# Altium project unisat_trx_hw.PrjPCB
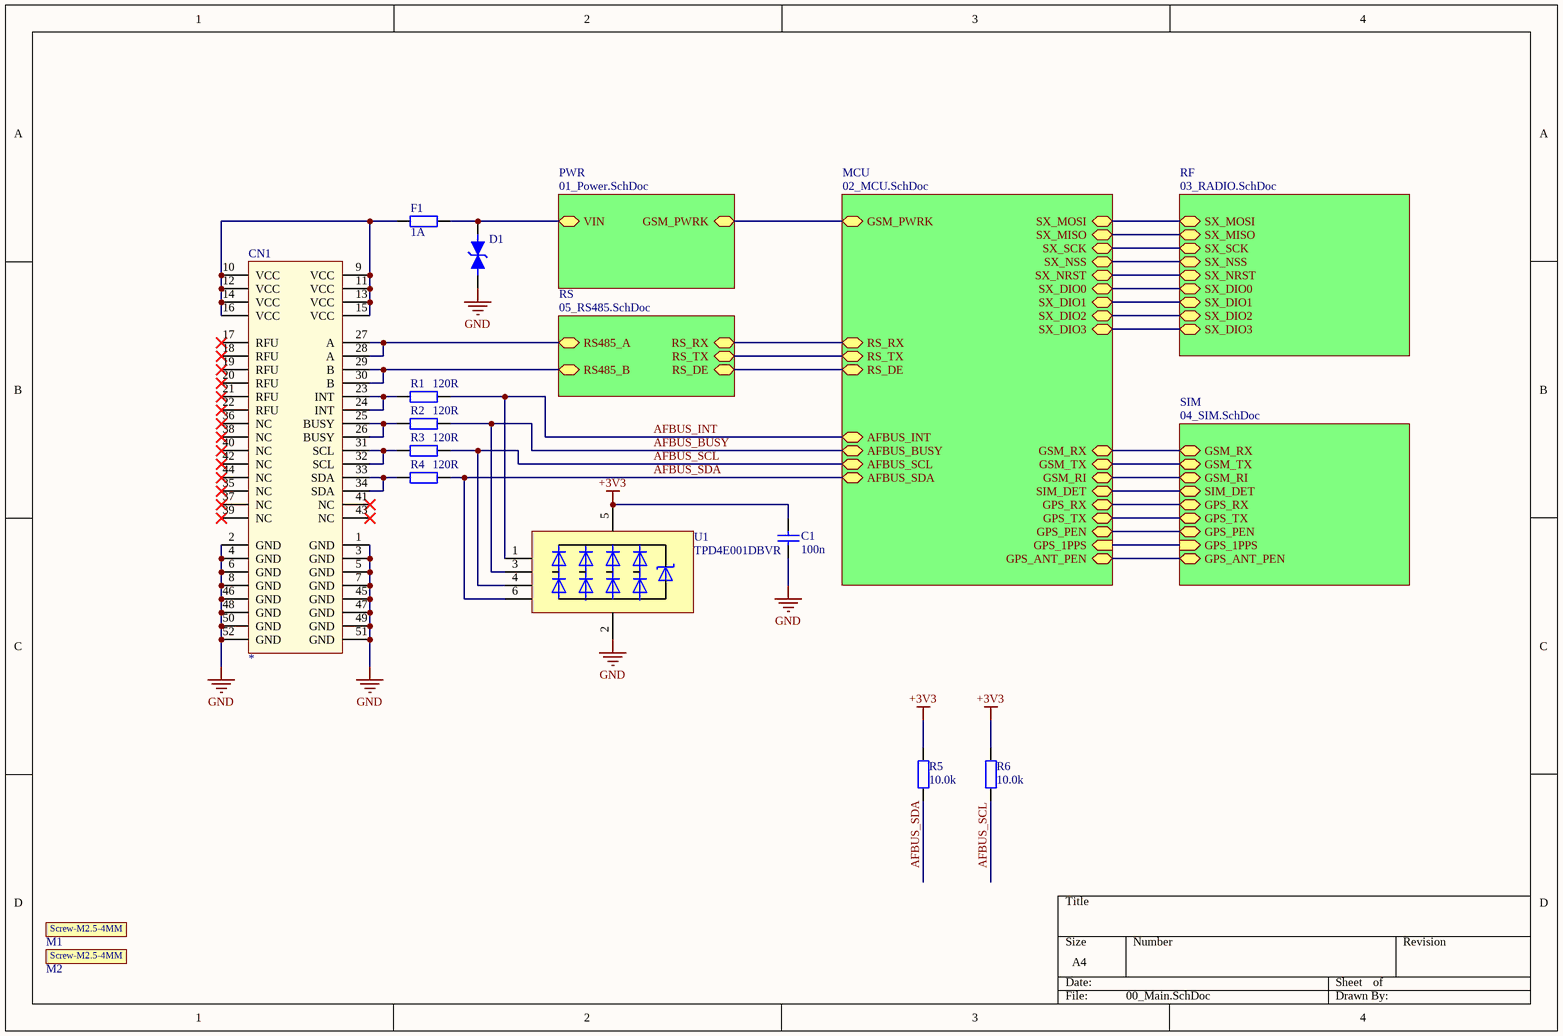
[diagram p0: 00_Main.SchDoc]
hwver: v03
6 sheets, 105 parts. Net scope: hierarchical (ports join the sheet entries above them; power ports are global).
Board files: unisat_trx_board.PcbDoc, unisat_trx_board_panelize.PcbDoc
Sheets:
  00_Main.SchDoc
    RS = 05_RS485.SchDoc
    PWR = 01_Power.SchDoc
    SIM = 04_SIM.SchDoc
    MCU = 02_MCU.SchDoc
    RF = 03_RADIO.SchDoc

## Sheet 00_Main.SchDoc
size A4

### Parts
C1  100n  [C0603_IPC_MD]
CN1  *  [PCI-E-MINI]  (no BOM)
D1  824501121  [DIOM4227X25N]  (value not drawn)
F1  1A  [R0603_IPC_MD]
M1  Screw-M2.5-4MM  (value not drawn)  (mechanical)
M2  Screw-M2.5-4MM  (value not drawn)  (mechanical)
R1  120R  [R0603_IPC_MD]
R2  120R  [R0603_IPC_MD]
R3  120R  [R0603_IPC_MD]
R4  120R  [R0603_IPC_MD]
R5  10.0k  [R0603_IPC_MD]
R6  10.0k  [R0603_IPC_MD]
U1  TPD4E001DBVR  [SOT23-6]

### Sub-sheets
MCU = 02_MCU.SchDoc: GSM_PWRK, RS_RX, RS_TX, RS_DE, SX_MOSI, SX_MISO, SX_SCK, SX_NSS, SX_NRST, SX_DIO1, SX_DIO2, SX_DIO3, SX_DIO0, AFBUS_SDA, AFBUS_SCL, AFBUS_BUSY, AFBUS_INT, GSM_RX, GSM_TX, GSM_RI, GPS_RX, GPS_TX, GPS_PEN, GPS_1PPS (in), SIM_DET, GPS_ANT_PEN
PWR = 01_Power.SchDoc: VIN, GSM_PWRK
RF = 03_RADIO.SchDoc: SX_MOSI, SX_MISO, SX_SCK, SX_NSS, SX_NRST, SX_DIO0, SX_DIO1, SX_DIO2, SX_DIO3
RS = 05_RS485.SchDoc: RS485_A, RS485_B, RS_RX, RS_TX, RS_DE
SIM = 04_SIM.SchDoc: GSM_RX, GSM_TX, GSM_RI, GPS_RX, GPS_TX, GPS_PEN, GPS_1PPS (in), SIM_DET, GPS_ANT_PEN

### Nets
+3V3: C1.1 R5.2 R6.2 U1.5(VCC)
GND: C1.2 CN1.1(GND) CN1.2(GND) CN1.3(GND) CN1.4(GND) CN1.5(GND) CN1.6(GND) CN1.7(GND) CN1.8(GND) CN1.45(GND) CN1.46(GND) CN1.47(GND) CN1.48(GND) CN1.49(GND) CN1.50(GND) CN1.51(GND) CN1.52(GND) D1.1 U1.2(GND)
AFBUS_BUSY: R2.2 U1.3(IO2) ; sheet MCU/AFBUS_BUSY
AFBUS_INT: R1.2 U1.1(IO1) ; sheet MCU/AFBUS_INT
AFBUS_SCL: R3.2 R6.1 U1.4(IO3) ; sheet MCU/AFBUS_SCL
AFBUS_SDA: R4.2 R5.1 U1.6(IO4) ; sheet MCU/AFBUS_SDA
SIM_DET: sheet SIM/SIM_DET, sheet MCU/SIM_DET
VIN: D1.2 F1.2 ; sheet PWR/VIN
NetCN1_9: CN1.9(VCC) CN1.10(VCC) CN1.11(VCC) CN1.12(VCC) CN1.13(VCC) CN1.14(VCC) CN1.15(VCC) CN1.16(VCC) F1.1
NetCN1_23: CN1.23(INT) CN1.24(INT) R1.1
NetCN1_25: CN1.25(BUSY) CN1.26(BUSY) R2.1
NetCN1_27: CN1.27(A) CN1.28(A) ; sheet RS/RS485_A
NetCN1_29: CN1.29(B) CN1.30(B) ; sheet RS/RS485_B
NetCN1_31: CN1.31(SCL) CN1.32(SCL) R3.1
NetCN1_33: CN1.33(SDA) CN1.34(SDA) R4.1
NetCN8_1: sheet RS/RS_RX, sheet MCU/RS_RX
NetCN8_2: sheet RS/RS_DE, sheet MCU/RS_DE
NetCN8_4: sheet RS/RS_TX, sheet MCU/RS_TX
NetR12_1: sheet PWR/GSM_PWRK, sheet MCU/GSM_PWRK
NetR21_1: sheet SIM/GSM_RI, sheet MCU/GSM_RI
NetR22_1: sheet SIM/GSM_RX, sheet MCU/GSM_RX
NetR23_1: sheet SIM/GSM_TX, sheet MCU/GSM_TX
NetR26_1: sheet SIM/GPS_PEN, sheet MCU/GPS_PEN
NetR29_1: sheet SIM/GPS_1PPS, sheet MCU/GPS_1PPS
NetR30_1: sheet SIM/GPS_RX, sheet MCU/GPS_RX
NetR31_1: sheet SIM/GPS_TX, sheet MCU/GPS_TX
NetR36_1: sheet SIM/GPS_ANT_PEN, sheet MCU/GPS_ANT_PEN
NetU4_22: sheet MCU/SX_NRST, sheet RF/SX_NRST
NetU4_23: sheet MCU/SX_DIO0, sheet RF/SX_DIO0
NetU4_24: sheet MCU/SX_DIO1, sheet RF/SX_DIO1
NetU4_25: sheet MCU/SX_DIO2, sheet RF/SX_DIO2
NetU4_26: sheet MCU/SX_DIO3, sheet RF/SX_DIO3
NetU4_34: sheet MCU/SX_SCK, sheet RF/SX_SCK
NetU4_35: sheet MCU/SX_MISO, sheet RF/SX_MISO
NetU4_36: sheet MCU/SX_MOSI, sheet RF/SX_MOSI
NetU4_37: sheet MCU/SX_NSS, sheet RF/SX_NSS

Not connected (* = marked no-connect by the designer): CN1 17(RFU)* 18(RFU)* 19(RFU)* 20(RFU)* 21(RFU)* 22(RFU)* 35(NC)* 36(NC)* 37(NC)* 38(NC)* 39(NC)* 40(NC)* 41(NC)* 42(NC)* 43(NC)* 44(NC)*

### Library data of the parts
C1 = CL10B104KO8WPNC: CAP CER 0.1UF 16V X7R 0603; Manufacturer: Samsung Electro-Mechanics; Manufacturer Part Number: CL10B104KO8WPNC; Voltage: 16V; Value: 100n; Dielectric: X7R; Supplier 1: Digi-Key; Supplier Part Number 1: 1276-6582-1-ND
CN1 = ALAFASAT_TRX_EDGE_CONN: EDGE CONN PCI EXP MINI 52POS; Manufacturer: *; Manufacturer Part Number: *; Supplier 1: *; Supplier Part Number 1: *
D1 = 824501121_TVS: TVS DIODE 12V 19.9V DO214AC; Manufacturer: Wurth Electronics Inc.; Voltage - Reverse Standoff (Typ): 12V (Max); Current - Average Rectified (Io): 1A; Manufacturer Part Number: 824501121; Supplier 1: Digi-Key; Supplier Part Number 1: 732-9949-1-ND
F1 = MFU0603FF01000P500: FUSE BOARD MOUNT 1A 32VDC 0603; Manufacturer: Bourns Inc.; Value: 1A; Manufacturer Part Number: MFU0603FF01000P500; Supplier 1: Digi-Key; Supplier Part Number 1: 749-1742-1-ND
M1 M2 = Screw-M2.5-4MM: Manufacturer: China; Manufacturer Part Number: Screw-M2.5-4MM; Supplier 1: Aliexpress; Supplier Part Number 1: Screw-M2.5-4MM
R1-R4 = RC0603JR-07120RL: RES SMD 120 OHM 5% 1/10W 0603; Manufacturer: Yageo; Value: 120R; Tolarance: 5%; Manufacturer Part Number: RC0603JR-07120RL; Supplier 1: Digi-Key; Supplier Part Number 1: 311-120GRCT-ND
R5 R6 = RMCF0603FT10K0: RES 10K OHM 1% 1/10W 0603; Manufacturer: Stackpole Electronics Inc; Value: 10.0k; Tolarance: 1%; Manufacturer Part Number: RMCF0603FT10K0; Supplier 1: Digi-Key; Supplier Part Number 1: RMCF0603FT10K0CT-ND
U1 = TPD4E001DBVR: 4x TVS DIODE 5.5V SOT23-6; Manufacturer: TI; Manufacturer Part Number: TPD4E001DBVR; Supplier 1: Digi-Key; Supplier Part Number 1: 296-28203-1-ND

## Sheet 05_RS485.SchDoc
size A4; Revision: A
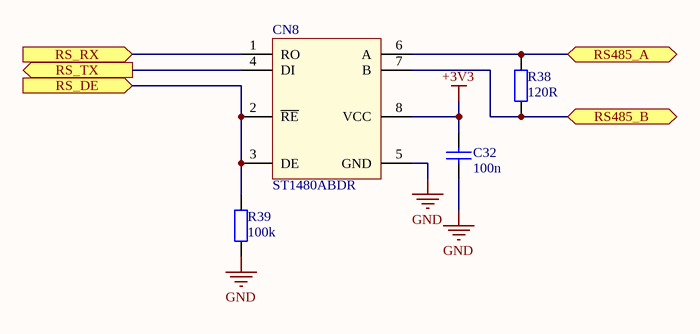
[diagram p1: 05_RS485.SchDoc]

### Parts
C32  100n  [C0603_IPC_MD]
CN8  ST1480ABDR  [SOIC-8]
R38  120R  [R0603_IPC_MD]
R39  100k  [R0603_IPC_MD]

### Ports
RS485_A (bidir), RS485_B (bidir), RS_DE (in), RS_RX (in), RS_TX (out)

### Nets
+3V3: C32.2 CN8.8(VCC)
GND: C32.1 CN8.5(GND) R39.1
NetCN1_27: CN8.6(A) R38.2 ; port RS485_A
NetCN1_29: CN8.7(B) R38.1 ; port RS485_B
NetCN8_1: CN8.1(RO) ; port RS_RX
NetCN8_2: CN8.2(~{RE}) CN8.3(DE) R39.2 ; port RS_DE
NetCN8_4: CN8.4(DI) ; port RS_TX

### Notes on the sheet
- Title
- Size:
- Date:
- A4
- Number:
- Time:
- Revision:
- Sheet
- of
- File:

### Library data of the parts
C32 = CL10B104KO8WPNC: as C1 on sheet 00_Main; Manufacturer Part Number: CL10B104KO8WPNC; Voltage: 16V; Value: 100n; Dielectric: X7R; Supplier 1: Digi-Key; Supplier Part Number 1: 1276-6582-1-ND
CN8 = ST1480ABDR: IC TXRX 3.3V RS485/422 8 SOIC; Manufacturer: STMicroelectronics; Manufacturer Part Number: ST1480ABDR; Supplier 1: Digi-Key; Supplier Part Number 1: 497-2046-1-ND
R38 = RC0603JR-07120RL: as R1 on sheet 00_Main; Value: 120R; Tolarance: 5%; Manufacturer Part Number: RC0603JR-07120RL; Supplier 1: Digi-Key; Supplier Part Number 1: 311-120GRCT-ND
R39 = RMCF0603FT100K: RES 100K OHM 1% 1/10W 0603; Manufacturer: Bourns Inc.; Value: 100k; Tolarance: 1%; Manufacturer Part Number: RMCF0603FT100K; Supplier 1: Digi-Key; Supplier Part Number 1: RMCF0603FT100KCT-ND

## Sheet 01_Power.SchDoc
size A3
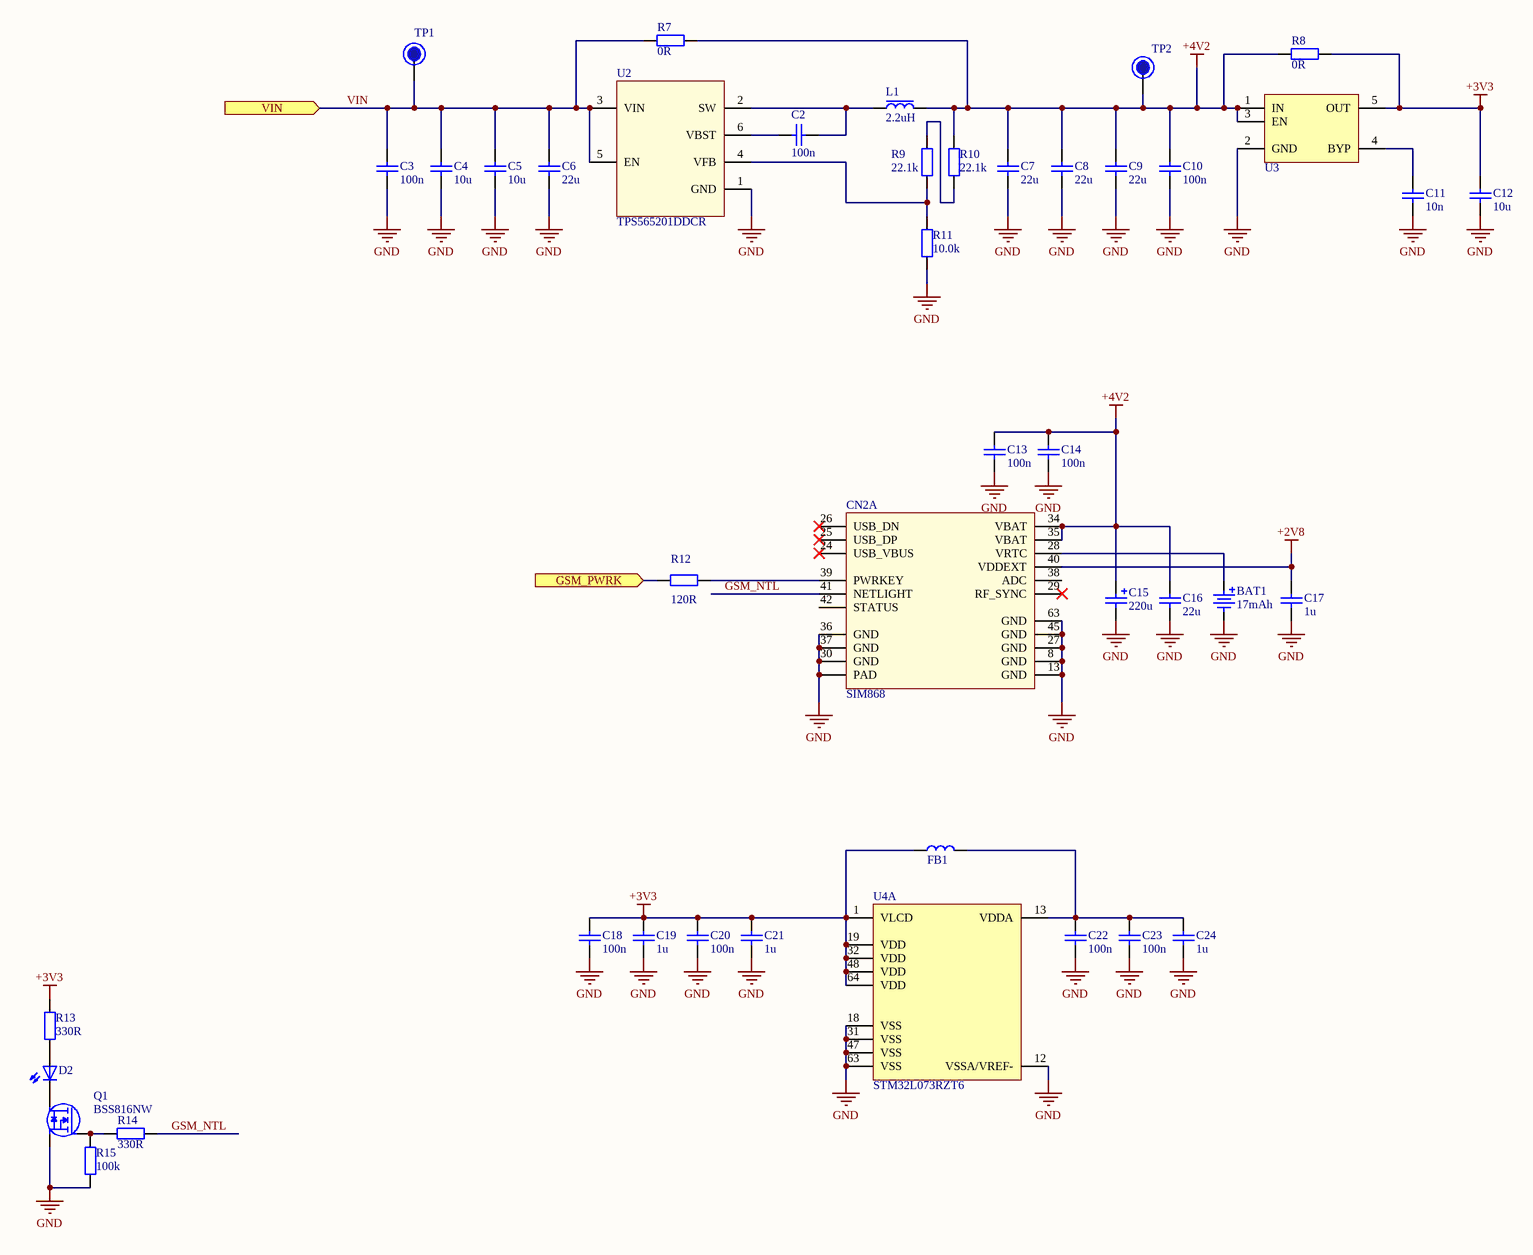
[diagram p2: 01_Power.SchDoc]

### Parts
BAT1  17mAh  [ML1220]
C2  100n  [C0603_IPC_MD]
C3  100n  [C0603_IPC_MD]
C4  10u  [C0805_IPC_MD]
C5  10u  [C0805_IPC_MD]
C6  22u  [C0805_IPC_MD]
C7  22u  [C0805_IPC_MD]
C8  22u  [C0805_IPC_MD]
C9  22u  [C0805_IPC_MD]
C10  100n  [C0603_IPC_MD]
C11  10n  [C0603_IPC_MD]
C12  10u  [C0805_IPC_MD]
C13  100n  [C0603_IPC_MD]
C14  100n  [C0603_IPC_MD]
C15  220u  [TANT_CAP_7343]
C16  22u  [C0805_IPC_MD]
C17  1u  [C0603_IPC_MD]
C18  100n  [C0603_IPC_MD]
C19  1u  [C0603_IPC_MD]
C20  100n  [C0603_IPC_MD]
C21  1u  [C0603_IPC_MD]
C22  100n  [C0603_IPC_MD]
C23  100n  [C0603_IPC_MD]
C24  1u  [C0603_IPC_MD]
CN2  SIM868  [SIM868]  (part A of 2)
D2  LTST-C190GKT  [LED_0603]  (value not drawn)
FB1  MH1608-601Y  [L0603_IPC_MD]  (value not drawn)
L1  2.2uH  [ASPI-0520LR]
Q1  BSS816NW  [SOT323]
R7  0R  [R0603_IPC_MD]  (no BOM)
R8  0R  [R0603_IPC_MD]  (no BOM)
R9  22.1k  [R0603_IPC_MD]
R10  22.1k  [R0603_IPC_MD]
R11  10.0k  [R0603_IPC_MD]
R12  120R  [R0603_IPC_MD]
R13  330R  [R0603_IPC_MD]
R14  330R  [R0603_IPC_MD]
R15  100k  [R0603_IPC_MD]
TP1  VIN  [TestPoint_1M5]  (value not drawn)  (no BOM)
TP2  4V2  [TestPoint_1M5]  (value not drawn)  (no BOM)
U2  TPS565201DDCR  [SOT23-6_(TI)]
U3  MIC5219-3.3YM5-TR  [SOT23-5_(MT)]  (value not drawn)
U4  STM32L073RZT6  [LQFP64_10X10MM]  (part A of 2)

### Ports
GSM_PWRK (in), VIN (in)

### Nets
+2V8: C17.2 CN2.40(VDDEXT)
+3V3: C12.2 C18.2 C19.2 C20.2 C21.2 FB1.1 R8.2 R13.2 U3.5(OUT) U4.1(VLCD) U4.19(VDD) U4.32(VDD) U4.48(VDD) U4.64(VDD)
+4V2: C7.1 C8.1 C9.1 C10.1 C13.2 C14.2 C15.1 C16.1 CN2.34(VBAT) CN2.35(VBAT) L1.2 R7.2 R8.1 R10.2 TP2.0 U3.1(IN) U3.3(EN)
GND: BAT1.2 C3.2 C4.1 C5.1 C6.2 C7.2 C8.2 C9.2 C10.2 C11.1 C12.1 C13.1 C14.1 C15.2 C16.2 C17.1 C18.1 C19.1 C20.1 C21.1 C22.1 C23.1 C24.1 CN2.8(GND) CN2.13(GND) CN2.27(GND) CN2.30(GND) CN2.36(GND) CN2.37(GND) CN2.45(GND) CN2.63(GND) CN2.PAD Q1.2(S) R11.1 R15.1 U2.1(GND) U3.2(GND) U4.12(VSSA/VREF-) U4.18(VSS) U4.31(VSS) U4.47(VSS) U4.63(VSS)
GSM_NTL: CN2.41(NETLIGHT) R14.2
VIN: C3.1 C4.2 C5.2 C6.1 R7.1 TP1.0 U2.3(VIN) U2.5(EN) ; port VIN
NetBAT1_1: BAT1.1 CN2.28(VRTC)
NetC2_1: C2.1 L1.1 U2.2(SW)
NetC2_2: C2.2 U2.6(VBST)
NetC11_2: C11.2 U3.4(BYP)
NetC22_2: C22.2 C23.2 C24.2 FB1.2 U4.13(VDDA)
NetCN2_39: CN2.39(PWRKEY) R12.2
NetD2_1: D2.1(C) Q1.3(D)
NetD2_2: D2.2(A) R13.1
NetQ1_1: Q1.1(G) R14.1 R15.2
NetR9_1: R9.1 R11.2 U2.4(VFB)
NetR9_2: R9.2 R10.1
NetR12_1: R12.1 ; port GSM_PWRK

Not connected (* = marked no-connect by the designer): CN2 24(USB_VBUS)* 25(USB_DP)* 26(USB_DN)* 29(RF_SYNC)* 38(ADC) 42(STATUS)

### Library data of the parts
BAT1 = ML1220: BATT LITH 3V 17MAH COIN 12.5MM; Manufacturer: CHINA; Manufacturer Part Number: ML1220; Value: 17mAh; Voltage: 3V; Supplier 1: Aliexpress; Supplier Part Number 1: ML1220
C2 C3 C10 = CL10B104KO8NNNC: CAP CER 0.1UF 16V X7R 0603; Manufacturer: Samsung Electro-Mechanics; Manufacturer Part Number: CL10B104KO8NNNC; Voltage: 16V; Value: 100n; Dielectric: X7R; Supplier 1: Digi-Key; Supplier Part Number 1: 1276-1005-1-ND
C4 C5 C12 = CL21B106KOQNNNG: CAP CER 10UF 16V X7R 0805; Manufacturer: Samsung Electro-Mechanics; Manufacturer Part Number: CL21B106KOQNNNG; Voltage: 16V; Value: 10u; Dielectric: X7R; Supplier 1: Digi-Key; Supplier Part Number 1: 1276-6472-1-ND
C6-C9 C16 = CL21A226MOCLRNC: CAP CER 22UF 16V X5R 0805; Manufacturer: Samsung Electro-Mechanics; Manufacturer Part Number: CL21A226MOCLRNC; Voltage: 16V; Value: 22u; Dielectric: X5R; Supplier 1: Digi-Key; Supplier Part Number 1: 1276-6780-1-ND
C11 = CL10B103KB8NNNC: CAP CER 0.01UF 50V X7R 0603; Manufacturer: Samsung Electro-Mechanics; Manufacturer Part Number: CL10B103KB8NNNC; Voltage: 50V; Value: 10n; Dielectric: X7R; Supplier 1: Digi-Key; Supplier Part Number 1: 1276-1009-1-ND
C13 C14 C18 C20 C22 C23 = CL10B104KO8WPNC: as C1 on sheet 00_Main; Manufacturer Part Number: CL10B104KO8WPNC; Voltage: 16V; Value: 100n; Dielectric: X7R; Supplier 1: Digi-Key; Supplier Part Number 1: 1276-6582-1-ND
C15 = 6TPE220MI: Tantalum Capacitors 220uF 6.3V CASE-D_7343 RoHS; Manufacturer: PANASONIC; Manufacturer Part Number: 6TPE220MI; Value: 220u; Voltage: 6.3V; Supplier 1: LCSC; Supplier Part Number 1: C129173
C17 C19 C21 C24 = CL10B105MO8NNWC: CAP CER 1UF 16V X7R 0603; Manufacturer: Samsung Electro-Mechanics; Manufacturer Part Number: CL10B105MO8NNWC; Voltage: 16V; Value: 1u; Dielectric: X7R; Supplier 1: Digi-Key; Supplier Part Number 1: 1276-6524-1-ND
CN2 = SIM868: GSM & GPRS & GPS Modules PCBModule RoHS; Manufacturer: SIMCom Wireless Solutions; Manufacturer Part Number: SIM868; Supplier 1: LCSC; Supplier Part Number 1: C89549
D2 = LTST-C190GKT: LED GREEN CLEAR CHIP SMD 0603; Manufacturer: Lite-On Inc.; Manufacturer Part Number: LTST-C190GKT; Color: Green; Supplier 1: Digi-Key; Supplier Part Number 1: 160-1183-1-ND
FB1 = MH1608-601Y: FERRITE BEAD 600R@100MHz 0603 for Power Line, 1000mA; Manufacturer: Bourns Inc.; Manufacturer Part Number: MH1608-601Y; Supplier 1: Digi-Key; Supplier Part Number 1: MH1608-601YCT-ND
L1 = ASPI-0520LR-2R2M-T2: FIXED IND 2.2UH 5.5A 36 MOHM SMD; Manufacturer: Abracon LLC; Manufacturer Part Number: ASPI-0520LR-2R2M-T2; Value: 2.2uH; Supplier 1: Digi-Key; Supplier Part Number 1: ASPI-0520LR-2R2M-T2CT-ND
Q1 = BSS816: N-Channel Logic Level Enhancement Mode Field Effect Transistor; Manufacturer: Infineon Technologies; Manufacturer Part Number: BSS816NW; Supplier 1: Digi-Key; Supplier Part Number 1: BSS816NWH6327XTSA1CT-ND
R7 R8 = CR0603-J/-000ELF: RES SMD 0 OHM JUMPER 1/10W 0603; Manufacturer: Bourns Inc.; Tolarance: 1%; Value: 0R; Manufacturer Part Number: CR0603-J/-000ELF; Supplier 1: Digi-Key; Supplier Part Number 1: CR0603-J/-000ELFCT-ND
R9 R10 = RC0603FR-0722K1L: RES SMD 22.1K OHM 1% 1/10W 0603; Manufacturer: Yageo; Value: 22.1k; Tolarance: 1%; Manufacturer Part Number: RC0603FR-0722K1L; Supplier 1: Digi-Key; Supplier Part Number 1: 311-22.1KHRCT-ND
R11 = RMCF0603FT10K0: as R5 on sheet 00_Main; Value: 10.0k; Tolarance: 1%; Manufacturer Part Number: RMCF0603FT10K0; Supplier 1: Digi-Key; Supplier Part Number 1: RMCF0603FT10K0CT-ND
R12 = RC0603JR-07120RL: as R1 on sheet 00_Main; Value: 120R; Tolarance: 5%; Manufacturer Part Number: RC0603JR-07120RL; Supplier 1: Digi-Key; Supplier Part Number 1: 311-120GRCT-ND
R13 R14 = CR0603-JW-331ELF: RES SMD 330 OHM 5% 1/10W 0603; Manufacturer: Bourns Inc.; Value: 330R; Tolarance: 5%; Manufacturer Part Number: CR0603-JW-331ELF; Supplier 1: Digi-Key; Supplier Part Number 1: CR0603-JW-331ELFCT-ND
R15 = RMCF0603FT100K: as R39 on sheet 05_RS485; Value: 100k; Tolarance: 1%; Manufacturer Part Number: RMCF0603FT100K; Supplier 1: Digi-Key; Supplier Part Number 1: RMCF0603FT100KCT-ND
TP1 TP2 = TP: Test Point
U2 = TPS565201DDCR: Buck Switching Regulator IC Positive Adjustable 0.76V 1 Output 5A SOT-23-6 Thin, TSOT-23-6; Manufacturer: TI; Manufacturer Part Number: TPS565201DDCR; Supplier 1: Digi-Key; Supplier Part Number 1: 296-49006-1-ND
U3 = MIC5219-3.3YM5-TR: IC REG LINEAR 3.3V 500MA SOT23-5; Manufacturer: Microchip Technology; Manufacturer Part Number: MIC5219-3.3YM5-TR; Supplier 1: Digi-Key; Supplier Part Number 1: 576-1281-1-ND
U4 = STM32L073RZT6: Ultra-low-power 32-bit MCU ARM®-based Cortex®-M0+; Manufacturer: ST; SRAM: 20KB; FLASH: 192KB; Manufacturer Part Number: STM32L073RZT6; Supplier 1: Digi-Key; Supplier Part Number 1: 497-16270-ND

## Sheet 04_SIM.SchDoc
size A4
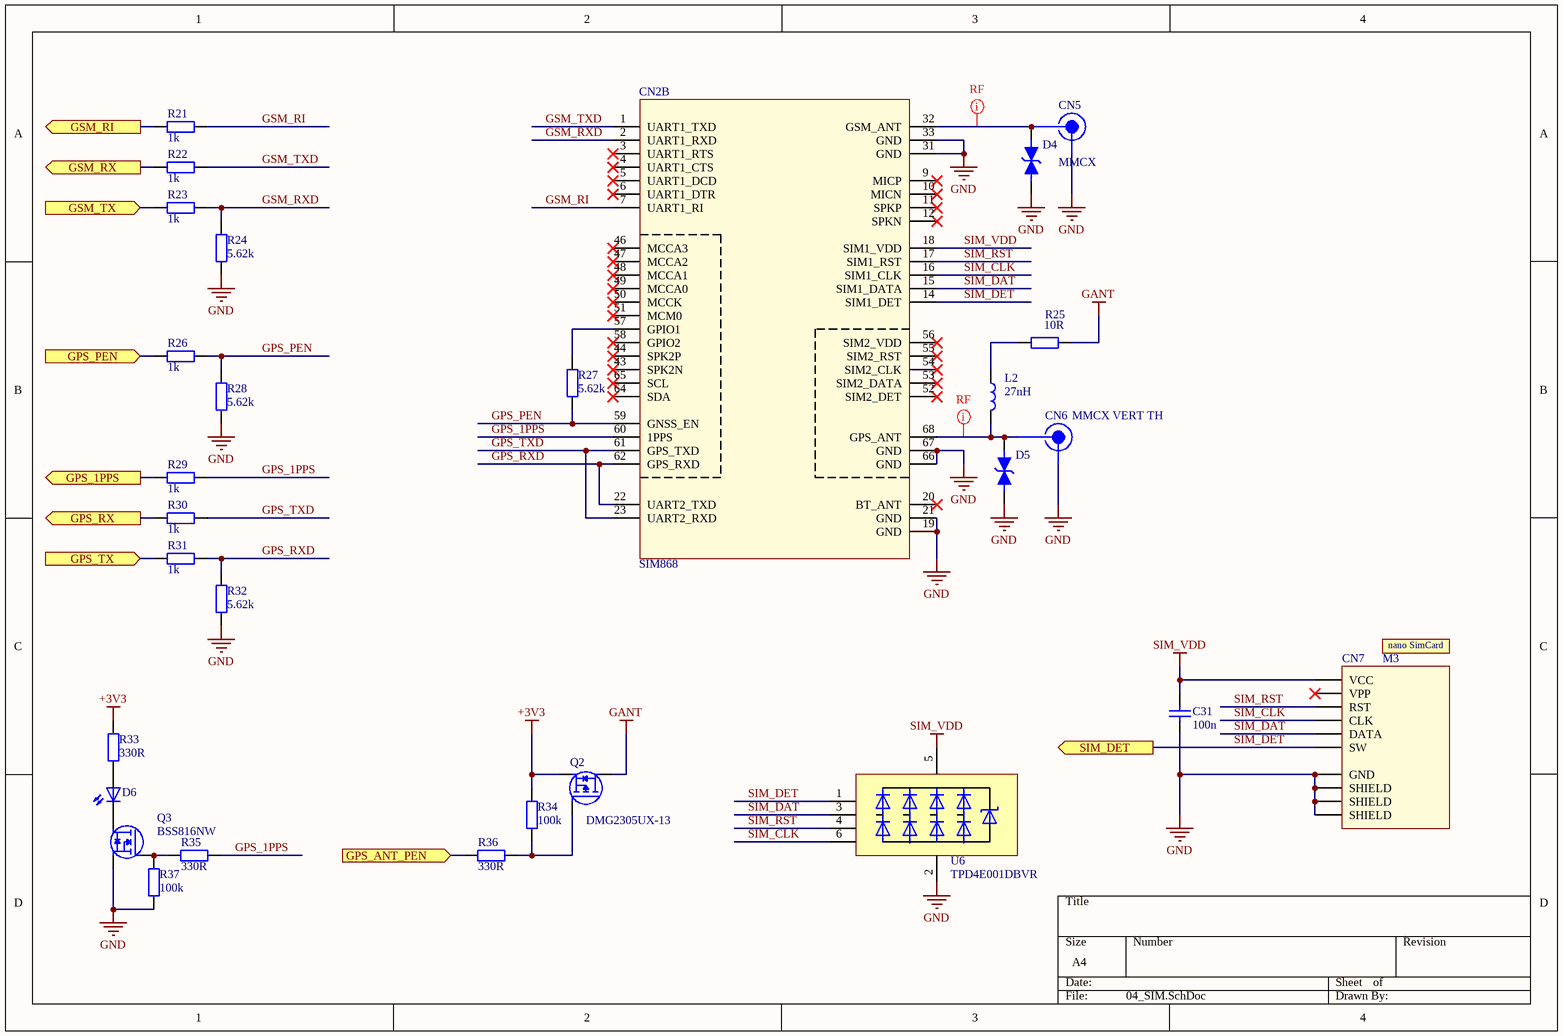
[diagram p3: 04_SIM.SchDoc]

### Parts
C31  100n  [C0603_IPC_MD]
CN2  SIM868  [SIM868]  (part B of 2)
CN5  MMCX  [MMCX_EDGE]
CN6  MMCX VERT TH  [MMCX_VERT_TH]
CN7  SNO-1305-B  [SNO-1305-B]  (value not drawn)
D4  LXES15AAA1-153  [C0402_IPC_MD]  (value not drawn)
D5  LXES15AAA1-153  [C0402_IPC_MD]  (value not drawn)  (no BOM)
D6  LTST-C190GKT  [LED_0603]  (value not drawn)
L2  27nH  [L0603_IPC_MD]
M3  SIMCARD-NANO  (value not drawn)  (mechanical)
Q2  DMG2305UX-13  [SOT23]
Q3  BSS816NW  [SOT323]
R21  1k  [R0603_IPC_MD]
R22  1k  [R0603_IPC_MD]
R23  1k  [R0603_IPC_MD]
R24  5.62k  [R0603_IPC_MD]
R25  10R  [R0603_IPC_MD]
R26  1k  [R0603_IPC_MD]  (no BOM)
R27  5.62k  [R0603_IPC_MD]
R28  5.62k  [R0603_IPC_MD]  (no BOM)
R29  1k  [R0603_IPC_MD]
R30  1k  [R0603_IPC_MD]  (no BOM)
R31  1k  [R0603_IPC_MD]  (no BOM)
R32  5.62k  [R0603_IPC_MD]
R33  330R  [R0603_IPC_MD]
R34  100k  [R0603_IPC_MD]
R35  330R  [R0603_IPC_MD]
R36  330R  [R0603_IPC_MD]
R37  100k  [R0603_IPC_MD]
U6  TPD4E001DBVR  [SOT23-6]

### Ports
GPS_1PPS (out), GPS_ANT_PEN (in), GPS_PEN (in), GPS_RX (out), GPS_TX (in), GSM_RI (out), GSM_RX (out), GSM_TX (in), SIM_DET (out)

### Nets
+3V3: Q2.2(S) R33.2 R34.2
GANT: Q2.3(D) R25.2
GND: C31.1 CN2.19(GND) CN2.21(GND) CN2.31(GND) CN2.33(GND) CN2.66(GND) CN2.67(GND) CN5.1 CN6.1 CN7.C5(GND) CN7.S1(SHIELD) CN7.S2(SHIELD) CN7.S3(SHIELD) D4.1 D5.1 Q3.2(S) R24.1 R28.1 R32.1 R37.1 U6.2(GND)
SIM_VDD: C31.2 CN2.18(SIM1_VDD) CN7.C1(VCC) U6.5(VCC)
GPS_1PPS: CN2.60(1PPS) R29.2 R35.2
GPS_PEN: CN2.59(GNSS_EN) R26.2 R27.1 R28.2
GPS_RXD: CN2.22(UART2_TXD) CN2.62(GPS_RXD) R31.2 R32.2
GPS_TXD: CN2.23(UART2_RXD) CN2.61(GPS_TXD) R30.2
GSM_RI: CN2.7(UART1_RI) R21.2
GSM_RXD: CN2.2(UART1_RXD) R23.2 R24.2
GSM_TXD: CN2.1(UART1_TXD) R22.2
SIM_CLK: CN2.16(SIM1_CLK) CN7.C3(CLK) U6.6(IO4)
SIM_DAT: CN2.15(SIM1_DATA) CN7.C7(DATA) U6.3(IO2)
SIM_DET: CN2.14(SIM1_DET) CN7.SW U6.1(IO1) ; port SIM_DET
SIM_RST: CN2.17(SIM1_RST) CN7.C2(RST) U6.4(IO3)
NetCN2_32: CN2.32(GSM_ANT) CN5.2 D4.2
NetCN2_57: CN2.57(GPIO1) R27.2
NetCN2_68: CN2.68(GPS_ANT) CN6.2 D5.2 L2.2
NetD6_1: D6.1(C) Q3.3(D)
NetD6_2: D6.2(A) R33.1
NetL2_1: L2.1 R25.1
NetQ2_1: Q2.1(G) R34.1 R36.2
NetQ3_1: Q3.1(G) R35.1 R37.2
NetR21_1: R21.1 ; port GSM_RI
NetR22_1: R22.1 ; port GSM_RX
NetR23_1: R23.1 ; port GSM_TX
NetR26_1: R26.1 ; port GPS_PEN
NetR29_1: R29.1 ; port GPS_1PPS
NetR30_1: R30.1 ; port GPS_RX
NetR31_1: R31.1 ; port GPS_TX
NetR36_1: R36.1 ; port GPS_ANT_PEN

Not connected (* = marked no-connect by the designer): CN2 3(UART1_RTS)* 4(UART1_CTS)* 5(UART1_DCD)* 6(UART1_DTR)* 9(MICP)* 10(MICN)* 11(SPKP)* 12(SPKN)* 20(BT_ANT)* 43(SPK2N)* 44(SPK2P)* 46(MCCA3)* 47(MCCA2)* 48(MCCA1)* 49(MCCA0)* 50(MCCK)* 51(MCM0)* 52(SIM2_DET)* 53(SIM2_DATA)* 54(SIM2_CLK)* 55(SIM2_RST)* 56(SIM2_VDD)* 58(GPIO2)* 64(SDA)* 65(SCL)*; CN7 C6(VPP)*

### Layout directives
net class RF50: NetCN2_32, NetCN2_68

### Notes on the sheet
- (in symbol SIMCARD-NANO) nano SimCard

### Library data of the parts
C31 = CL10B104KO8WPNC: as C1 on sheet 00_Main; Manufacturer Part Number: CL10B104KO8WPNC; Voltage: 16V; Value: 100n; Dielectric: X7R; Supplier 1: Digi-Key; Supplier Part Number 1: 1276-6582-1-ND
CN2 = SIM868: as CN2 on sheet 01_Power; Manufacturer Part Number: SIM868; Supplier 1: LCSC; Supplier Part Number 1: C89549
CN5 = MMCX: MMCX PCB EDGE CONN; Manufacturer: China; Manufacturer Part Number: MMCX; Supplier 1: Aliexpress; Supplier Part Number 1: MMCX
CN6 = MMCX_VERT: MMCX PCB TH VERT CONN; Manufacturer: China; Manufacturer Part Number: MMCX VERT TH; Supplier 1: Aliexpress; Supplier Part Number 1: MMCX VERT TH
CN7 = SNO-1305-B: Hinged Sim Card Connector. With 6 contacts, with switch for card detection. Profile above PCB is 1.43mm.; Manufacturer: SOFNG; Manufacturer Part Number: SNO-1305-B; Supplier 1: LCSC; Supplier Part Number 1: C111371
D4 D5 = LXES15AAA1-153: TVS DIODE 4V 0402; Manufacturer: Murata Electronics North America; Manufacturer Part Number: LXES15AAA1-153; Voltage - Reverse Standoff (Typ): 4V; Supplier 1: Digi-Key; Supplier Part Number 1: 490-13210-1-ND
D6 = LTST-C190GKT: as D2 on sheet 01_Power; Manufacturer Part Number: LTST-C190GKT; Color: Green; Supplier 1: Digi-Key; Supplier Part Number 1: 160-1183-1-ND
L2 = LQW18AN27NJ00D: 27nH Unshielded Wirewound Inductor 440mA 210mOhm Max 0603 (1608 Metric); Manufacturer: Murata Electronics; Manufacturer Part Number: LQW18AN27NJ00D; Supplier 1: Digi-Key; Supplier Part Number 1: 490-1174-1-ND; Value: 27nH
M3 = SIMCARD-NANO: Nano SimCard; Manufacturer: Beeline; Manufacturer Part Number: SIMCARD-NANO; Supplier 1: Beeline; Supplier Part Number 1: SIMCARD-NANO
Q2 = DMG2305: MOSFET P-CH 20V 4.2A SOT23; Manufacturer: Diodes Inc.; Manufacturer Part Number: DMG2305UX-13; Supplier 1: Digi-Key; Supplier Part Number 1: DMG2305UX-13DICT-ND
Q3 = BSS816: as Q1 on sheet 01_Power; Manufacturer Part Number: BSS816NW; Supplier 1: Digi-Key; Supplier Part Number 1: BSS816NWH6327XTSA1CT-ND
R21-R23 R26 R29-R31 = CR0603-JW-102ELF: RES SMD 1K OHM 5% 1/10W 0603; Manufacturer: Bourns Inc.; Value: 1k; Tolarance: 5%; Manufacturer Part Number: CR0603-JW-102ELF; Supplier 1: Digi-Key; Supplier Part Number 1: CR0603-JW-102ELFCT-ND
R24 R27 R28 R32 = CR0603-JW-5.62kR: RES 5.62K OHM 1% 1/10W 0603; Manufacturer: Stackpole Electronics Inc; Manufacturer Part Number: RMCF0603FT5K62; Value: 5.62k; Tolarance: ±1%; Supplier 1: Digi-Key; Supplier Part Number 1: RMCF0603FT5K62CT-ND
R25 = CR0603-FX-10R0ELF: RES SMD 10 OHM 1% 1/10W 0603; Manufacturer: Bourns Inc.; Value: 10R; Tolarance: 1%; Manufacturer Part Number: CR0603-FX-10R0ELF; Supplier 1: Digi-Key; Supplier Part Number 1: CR0603-FX-10R0ELFCT-ND
R33 R35 R36 = CR0603-JW-331ELF: as R13 on sheet 01_Power; Value: 330R; Tolarance: 5%; Manufacturer Part Number: CR0603-JW-331ELF; Supplier 1: Digi-Key; Supplier Part Number 1: CR0603-JW-331ELFCT-ND
R34 R37 = RMCF0603FT100K: as R39 on sheet 05_RS485; Value: 100k; Tolarance: 1%; Manufacturer Part Number: RMCF0603FT100K; Supplier 1: Digi-Key; Supplier Part Number 1: RMCF0603FT100KCT-ND
U6 = TPD4E001DBVR: as U1 on sheet 00_Main; Manufacturer Part Number: TPD4E001DBVR; Supplier 1: Digi-Key; Supplier Part Number 1: 296-28203-1-ND

## Sheet 02_MCU.SchDoc
size A4
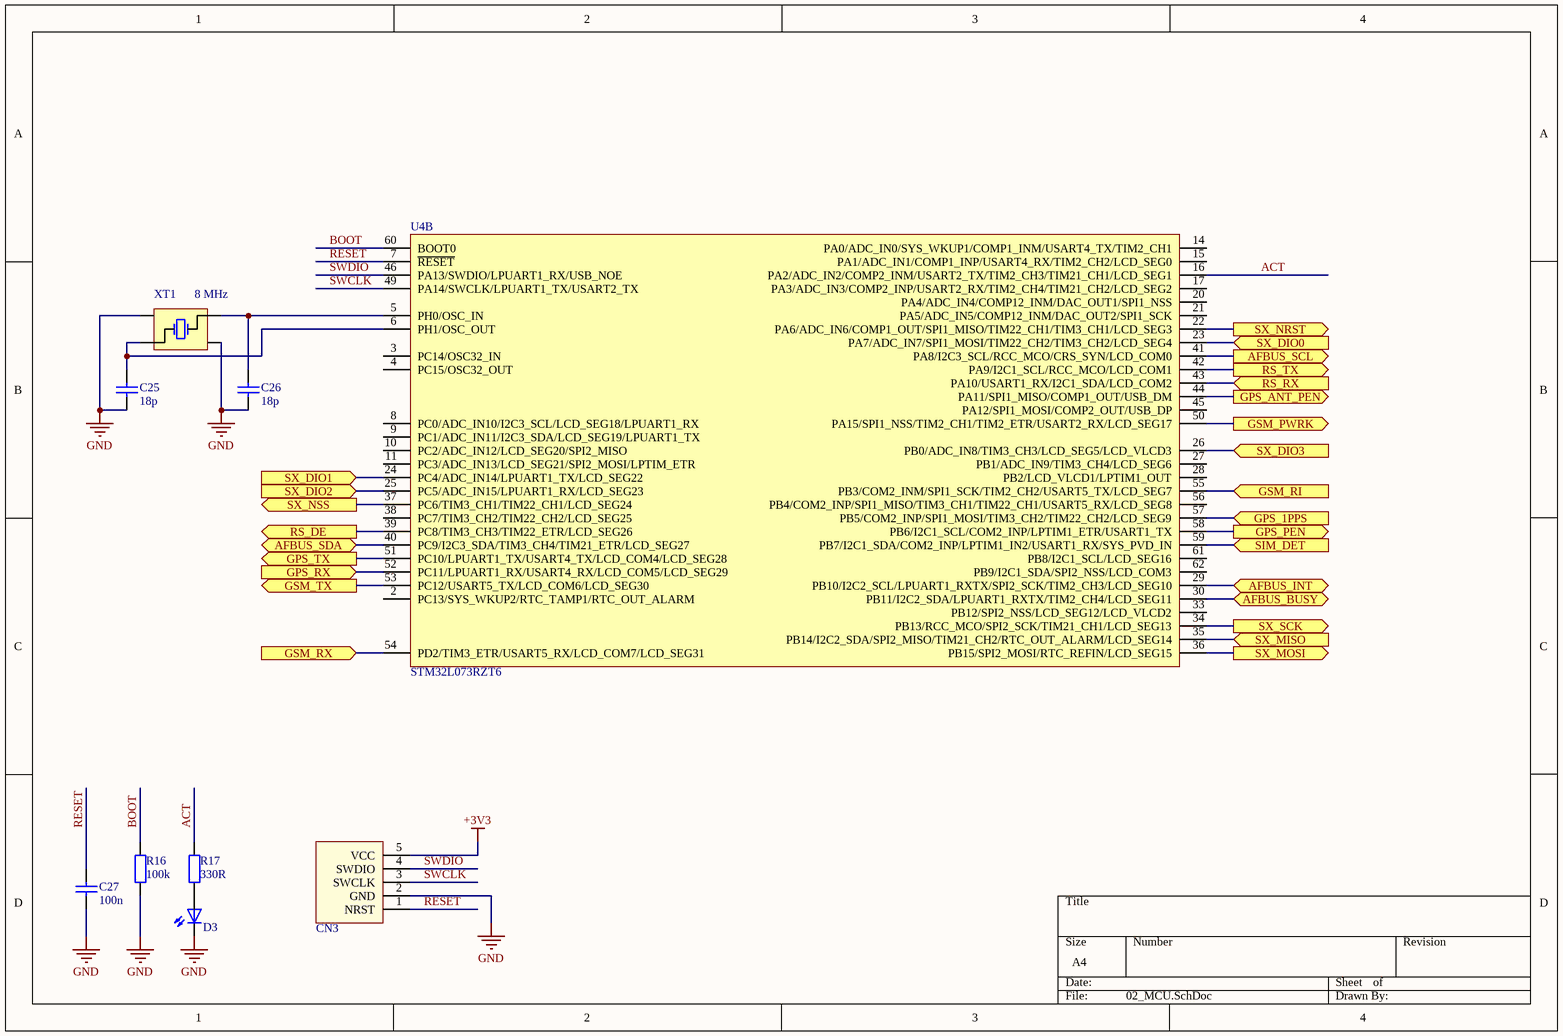
[diagram p4: 02_MCU.SchDoc]

### Parts
C25  18p  [C0603_IPC_MD]
C26  18p  [C0603_IPC_MD]
C27  100n  [C0603_IPC_MD]
CN3  SWD  [SWD_CON_VAR2]  (value not drawn)  (no BOM)
D3  LTST-C190GKT  [LED_0603]  (value not drawn)
R16  100k  [R0603_IPC_MD]
R17  330R  [R0603_IPC_MD]
U4  STM32L073RZT6  [LQFP64_10X10MM]  (part B of 2)
XT1  8 MHz  [5.0X3.2_4PAD_SMT]

### Ports
AFBUS_BUSY (bidir), AFBUS_INT (bidir), AFBUS_SCL (out), AFBUS_SDA (bidir), GPS_1PPS (in), GPS_ANT_PEN (out), GPS_PEN (out), GPS_RX (in), GPS_TX (out), GSM_PWRK (out), GSM_RI (in), GSM_RX (in), GSM_TX (out), RS_DE (out), RS_RX (in), RS_TX (out), SIM_DET (in), SX_DIO0 (in), SX_DIO1 (in), SX_DIO2 (in), SX_DIO3 (in), SX_MISO (in), SX_MOSI (out), SX_NRST (out), SX_NSS (out), SX_SCK (out)

### Nets
+3V3: CN3.5(VCC)
GND: C25.1 C26.1 C27.1 CN3.2(GND) D3.1(C) R16.1 XT1.2(NC) XT1.4(NC)
ACT: R17.1 U4.16(PA2/ADC_IN2/COMP2_INM/USART2_TX/TIM2_CH3/TIM21_CH1/LCD_SEG1)
AFBUS_BUSY: U4.30(PB11/I2C2_SDA/LPUART1_RXTX/TIM2_CH4/LCD_SEG11) ; port AFBUS_BUSY
AFBUS_INT: U4.29(PB10/I2C2_SCL/LPUART1_RXTX/SPI2_SCK/TIM2_CH3/LCD_SEG10) ; port AFBUS_INT
AFBUS_SCL: U4.41(PA8/I2C3_SCL/RCC_MCO/CRS_SYN/LCD_COM0) ; port AFBUS_SCL
AFBUS_SDA: U4.40(PC9/I2C3_SDA/TIM3_CH4/TIM21_ETR/LCD_SEG27) ; port AFBUS_SDA
BOOT: R16.2 U4.60(BOOT0)
RESET: C27.2 CN3.1(NRST) U4.7(~{RESET})
SIM_DET: U4.59(PB7/I2C1_SDA/COM2_INP/LPTIM1_IN2/USART1_RX/SYS_PVD_IN) ; port SIM_DET
SWCLK: CN3.3(SWCLK) U4.49(PA14/SWCLK/LPUART1_TX/USART2_TX)
SWDIO: CN3.4(SWDIO) U4.46(PA13/SWDIO/LPUART1_RX/USB_NOE)
NetC25_2: C25.2 U4.6(PH1/OSC_OUT) XT1.1(OSC1)
NetC26_2: C26.2 U4.5(PH0/OSC_IN) XT1.3(OSC2)
NetCN8_1: U4.43(PA10/USART1_RX/I2C1_SDA/LCD_COM2) ; port RS_RX
NetCN8_2: U4.39(PC8/TIM3_CH3/TIM22_ETR/LCD_SEG26) ; port RS_DE
NetCN8_4: U4.42(PA9/I2C1_SCL/RCC_MCO/LCD_COM1) ; port RS_TX
NetD3_2: D3.2(A) R17.2
NetR12_1: U4.50(PA15/SPI1_NSS/TIM2_CH1/TIM2_ETR/USART2_RX/LCD_SEG17) ; port GSM_PWRK
NetR21_1: U4.55(PB3/COM2_INM/SPI1_SCK/TIM2_CH2/USART5_TX/LCD_SEG7) ; port GSM_RI
NetR22_1: U4.54(PD2/TIM3_ETR/USART5_RX/LCD_COM7/LCD_SEG31) ; port GSM_RX
NetR23_1: U4.53(PC12/USART5_TX/LCD_COM6/LCD_SEG30) ; port GSM_TX
NetR26_1: U4.58(PB6/I2C1_SCL/COM2_INP/LPTIM1_ETR/USART1_TX) ; port GPS_PEN
NetR29_1: U4.57(PB5/COM2_INP/SPI1_MOSI/TIM3_CH2/TIM22_CH2/LCD_SEG9) ; port GPS_1PPS
NetR30_1: U4.52(PC11/LPUART1_RX/USART4_RX/LCD_COM5/LCD_SEG29) ; port GPS_RX
NetR31_1: U4.51(PC10/LPUART1_TX/USART4_TX/LCD_COM4/LCD_SEG28) ; port GPS_TX
NetR36_1: U4.44(PA11/SPI1_MISO/COMP1_OUT/USB_DM) ; port GPS_ANT_PEN
NetU4_22: U4.22(PA6/ADC_IN6/COMP1_OUT/SPI1_MISO/TIM22_CH1/TIM3_CH1/LCD_SEG3) ; port SX_NRST
NetU4_23: U4.23(PA7/ADC_IN7/SPI1_MOSI/TIM22_CH2/TIM3_CH2/LCD_SEG4) ; port SX_DIO0
NetU4_24: U4.24(PC4/ADC_IN14/LPUART1_TX/LCD_SEG22) ; port SX_DIO1
NetU4_25: U4.25(PC5/ADC_IN15/LPUART1_RX/LCD_SEG23) ; port SX_DIO2
NetU4_26: U4.26(PB0/ADC_IN8/TIM3_CH3/LCD_SEG5/LCD_VLCD3) ; port SX_DIO3
NetU4_34: U4.34(PB13/RCC_MCO/SPI2_SCK/TIM21_CH1/LCD_SEG13) ; port SX_SCK
NetU4_35: U4.35(PB14/I2C2_SDA/SPI2_MISO/TIM21_CH2/RTC_OUT_ALARM/LCD_SEG14) ; port SX_MISO
NetU4_36: U4.36(PB15/SPI2_MOSI/RTC_REFIN/LCD_SEG15) ; port SX_MOSI
NetU4_37: U4.37(PC6/TIM3_CH1/TIM22_CH1/LCD_SEG24) ; port SX_NSS

Not connected (* = marked no-connect by the designer): U4 2(PC13/SYS_WKUP2/RTC_TAMP1/RTC_OUT_ALARM) 3(PC14/OSC32_IN) 4(PC15/OSC32_OUT) 8(PC0/ADC_IN10/I2C3_SCL/LCD_SEG18/LPUART1_RX) 9(PC1/ADC_IN11/I2C3_SDA/LCD_SEG19/LPUART1_TX) 10(PC2/ADC_IN12/LCD_SEG20/SPI2_MISO) 11(PC3/ADC_IN13/LCD_SEG21/SPI2_MOSI/LPTIM_ETR) 14(PA0/ADC_IN0/SYS_WKUP1/COMP1_INM/USART4_TX/TIM2_CH1) 15(PA1/ADC_IN1/COMP1_INP/USART4_RX/TIM2_CH2/LCD_SEG0) 17(PA3/ADC_IN3/COMP2_INP/USART2_RX/TIM2_CH4/TIM21_CH2/LCD_SEG2) 20(PA4/ADC_IN4/COMP12_INM/DAC_OUT1/SPI1_NSS) 21(PA5/ADC_IN5/COMP12_INM/DAC_OUT2/SPI1_SCK) 27(PB1/ADC_IN9/TIM3_CH4/LCD_SEG6) 28(PB2/LCD_VLCD1/LPTIM1_OUT) 33(PB12/SPI2_NSS/LCD_SEG12/LCD_VLCD2) 38(PC7/TIM3_CH2/TIM22_CH2/LCD_SEG25) 45(PA12/SPI1_MOSI/COMP2_OUT/USB_DP) 56(PB4/COM2_INP/SPI1_MISO/TIM3_CH1/TIM22_CH1/USART5_RX/LCD_SEG8) 61(PB8/I2C1_SCL/LCD_SEG16) 62(PB9/I2C1_SDA/SPI2_NSS/LCD_COM3)

### Library data of the parts
C25 C26 = CL10C180JB8NNNC: CAP CER 18PF 50V C0G/NP0 0603; Manufacturer: Samsung Electro-Mechanics; Manufacturer Part Number: CL10C180JB8NNNC; Voltage: 50V; Value: 18p; Dielectric: C0G/NP0; Supplier 1: Digi-Key; Supplier Part Number 1: 1276-1089-1-ND
C27 = CL10B104KO8WPNC: as C1 on sheet 00_Main; Manufacturer Part Number: CL10B104KO8WPNC; Voltage: 16V; Value: 100n; Dielectric: X7R; Supplier 1: Digi-Key; Supplier Part Number 1: 1276-6582-1-ND
CN3 = SWD-CONNECTOR_VAR1: SWDIO SWCLK VDD GND NRST; Manufacturer: *; Manufacturer Part Number: *; Supplier 1: *; Supplier Part Number 1: *
D3 = LTST-C190GKT: as D2 on sheet 01_Power; Manufacturer Part Number: LTST-C190GKT; Color: Green; Supplier 1: Digi-Key; Supplier Part Number 1: 160-1183-1-ND
R16 = RMCF0603FT100K: as R39 on sheet 05_RS485; Value: 100k; Tolarance: 1%; Manufacturer Part Number: RMCF0603FT100K; Supplier 1: Digi-Key; Supplier Part Number 1: RMCF0603FT100KCT-ND
R17 = CR0603-JW-331ELF: as R13 on sheet 01_Power; Value: 330R; Tolarance: 5%; Manufacturer Part Number: CR0603-JW-331ELF; Supplier 1: Digi-Key; Supplier Part Number 1: CR0603-JW-331ELFCT-ND
U4 = STM32L073RZT6: as U4 on sheet 01_Power; Manufacturer Part Number: STM32L073RZT6; Supplier 1: Digi-Key; Supplier Part Number 1: 497-16270-ND
XT1 = ABM3B-8.000MHZ-10-1-U-T: 8MHz ±10ppm Crystal 10pF 200 Ohms 4-SMD, No Lead; Manufacturer: Abracon LLC; Manufacturer Part Number: ABM3B-8.000MHZ-10-1-U-T; Type: XTAL; Value: 8 MHz; Supplier 1: Digi-Key; Supplier Part Number 1: 535-9721-1-ND

## Sheet 03_RADIO.SchDoc
size A4
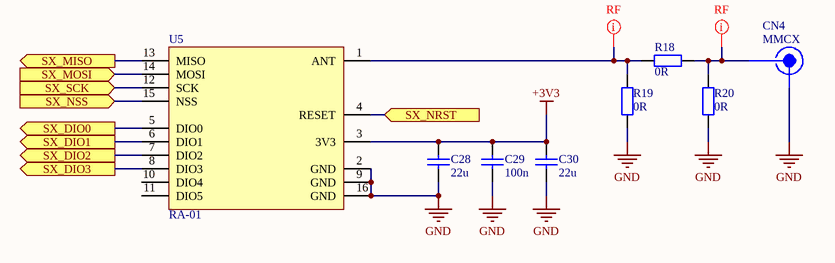
[diagram p5: 03_RADIO.SchDoc]

### Parts
C28  22u  [C0805_IPC_MD]
C29  100n  [C0603_IPC_MD]
C30  22u  [C0805_IPC_MD]
CN4  MMCX  [MMCX_EDGE]
R18  0R  [R0603_IPC_MD]
R19  0R  [R0603_IPC_MD]  (no BOM)
R20  0R  [R0603_IPC_MD]  (no BOM)
U5  RA-01  [RA-01]

### Ports
SX_DIO0 (out), SX_DIO1 (out), SX_DIO2 (out), SX_DIO3 (out), SX_MISO (out), SX_MOSI (in), SX_NRST (in), SX_NSS (in), SX_SCK (in)

### Nets
+3V3: C28.1 C29.1 C30.1 U5.3(3V3)
GND: C28.2 C29.2 C30.2 CN4.1 R19.1 R20.1 U5.2(GND) U5.9(GND) U5.16(GND)
NetCN4_2: CN4.2 R18.2 R20.2
NetR18_1: R18.1 R19.2 U5.1(ANT)
NetU4_22: U5.4(RESET) ; port SX_NRST
NetU4_23: U5.5(DIO0) ; port SX_DIO0
NetU4_24: U5.6(DIO1) ; port SX_DIO1
NetU4_25: U5.7(DIO2) ; port SX_DIO2
NetU4_26: U5.8(DIO3) ; port SX_DIO3
NetU4_34: U5.12(SCK) ; port SX_SCK
NetU4_35: U5.13(MISO) ; port SX_MISO
NetU4_36: U5.14(MOSI) ; port SX_MOSI
NetU4_37: U5.15(NSS) ; port SX_NSS

Not connected (* = marked no-connect by the designer): U5 10(DIO4) 11(DIO5)

### Layout directives
net class RF50: NetCN4_2, NetR18_1

### Library data of the parts
C28 C30 = CL21A226MOCLRNC: as C6 on sheet 01_Power; Manufacturer Part Number: CL21A226MOCLRNC; Voltage: 16V; Value: 22u; Dielectric: X5R; Supplier 1: Digi-Key; Supplier Part Number 1: 1276-6780-1-ND
C29 = CL10B104KO8WPNC: as C1 on sheet 00_Main; Manufacturer Part Number: CL10B104KO8WPNC; Voltage: 16V; Value: 100n; Dielectric: X7R; Supplier 1: Digi-Key; Supplier Part Number 1: 1276-6582-1-ND
CN4 = MMCX: MMCX PCB EDGE CONN; Manufacturer: China; Manufacturer Part Number: MMCX; Supplier 1: Aliexpress; Supplier Part Number 1: MMCX
R18-R20 = CR0603-J/-000ELF: as R7 on sheet 01_Power; Value: 0R; Manufacturer Part Number: CR0603-J/-000ELF; Supplier 1: Digi-Key; Supplier Part Number 1: CR0603-J/-000ELFCT-ND
U5 = RA-01: Wireless Modules SX1278; Manufacturer: Ai-Thinker; Manufacturer Part Number: RA-01; Supplier 1: LCSC; Supplier Part Number 1: C90040

## Nets that join several sheets
+3V3: 00_Main (C1.1 R5.2 R6.2 U1.5), 05_RS485 (C32.2 CN8.8), 01_Power (14 pins), 04_SIM (Q2.2 R33.2 R34.2), 02_MCU (CN3.5), 03_RADIO (C28.1 C29.1 C30.1 U5.3)
GND: 00_Main (19 pins), 05_RS485 (C32.1 CN8.5 R39.1), 01_Power (42 pins), 04_SIM (21 pins), 02_MCU (8 pins), 03_RADIO (9 pins)
AFBUS_BUSY: 00_Main (R2.2 U1.3), 02_MCU (U4.30)
AFBUS_INT: 00_Main (R1.2 U1.1), 02_MCU (U4.29)
AFBUS_SCL: 00_Main (R3.2 R6.1 U1.4), 02_MCU (U4.41)
AFBUS_SDA: 00_Main (R4.2 R5.1 U1.6), 02_MCU (U4.40)
NetCN1_27: 00_Main (CN1.27 CN1.28), 05_RS485 (CN8.6 R38.2)
NetCN1_29: 00_Main (CN1.29 CN1.30), 05_RS485 (CN8.7 R38.1)
NetCN8_1: 05_RS485 (CN8.1), 02_MCU (U4.43)
NetCN8_2: 05_RS485 (CN8.2 CN8.3 R39.2), 02_MCU (U4.39)
NetCN8_4: 05_RS485 (CN8.4), 02_MCU (U4.42)
NetR12_1: 01_Power (R12.1), 02_MCU (U4.50)
NetR21_1: 04_SIM (R21.1), 02_MCU (U4.55)
NetR22_1: 04_SIM (R22.1), 02_MCU (U4.54)
NetR23_1: 04_SIM (R23.1), 02_MCU (U4.53)
NetR26_1: 04_SIM (R26.1), 02_MCU (U4.58)
NetR29_1: 04_SIM (R29.1), 02_MCU (U4.57)
NetR30_1: 04_SIM (R30.1), 02_MCU (U4.52)
NetR31_1: 04_SIM (R31.1), 02_MCU (U4.51)
NetR36_1: 04_SIM (R36.1), 02_MCU (U4.44)
NetU4_22: 02_MCU (U4.22), 03_RADIO (U5.4)
NetU4_23: 02_MCU (U4.23), 03_RADIO (U5.5)
NetU4_24: 02_MCU (U4.24), 03_RADIO (U5.6)
NetU4_25: 02_MCU (U4.25), 03_RADIO (U5.7)
NetU4_26: 02_MCU (U4.26), 03_RADIO (U5.8)
NetU4_34: 02_MCU (U4.34), 03_RADIO (U5.12)
NetU4_35: 02_MCU (U4.35), 03_RADIO (U5.13)
NetU4_36: 02_MCU (U4.36), 03_RADIO (U5.14)
NetU4_37: 02_MCU (U4.37), 03_RADIO (U5.15)
SIM_DET: 04_SIM (CN2.14 CN7.SW U6.1), 02_MCU (U4.59)
VIN: 00_Main (D1.2 F1.2), 01_Power (8 pins)

## Assembly variants
BASIC: not fitted R26 R28 R30 R31 R32
NoSIMCOM: not fitted BAT1 C13 C14 C15 C16 C17 C31 CN2 CN5 CN6 CN7 D2 D4 D5 D6 L2 M3 Q1 Q2 Q3 R12 R13 R14 R15 R21 R22 R23 R24 R25 R26 R27 R28 R29 R30 R31 R32 R33 R34 R35 R36 R37 U6